# EAGLE design motherboard_Rev1_0 (EAGLE 4.16)
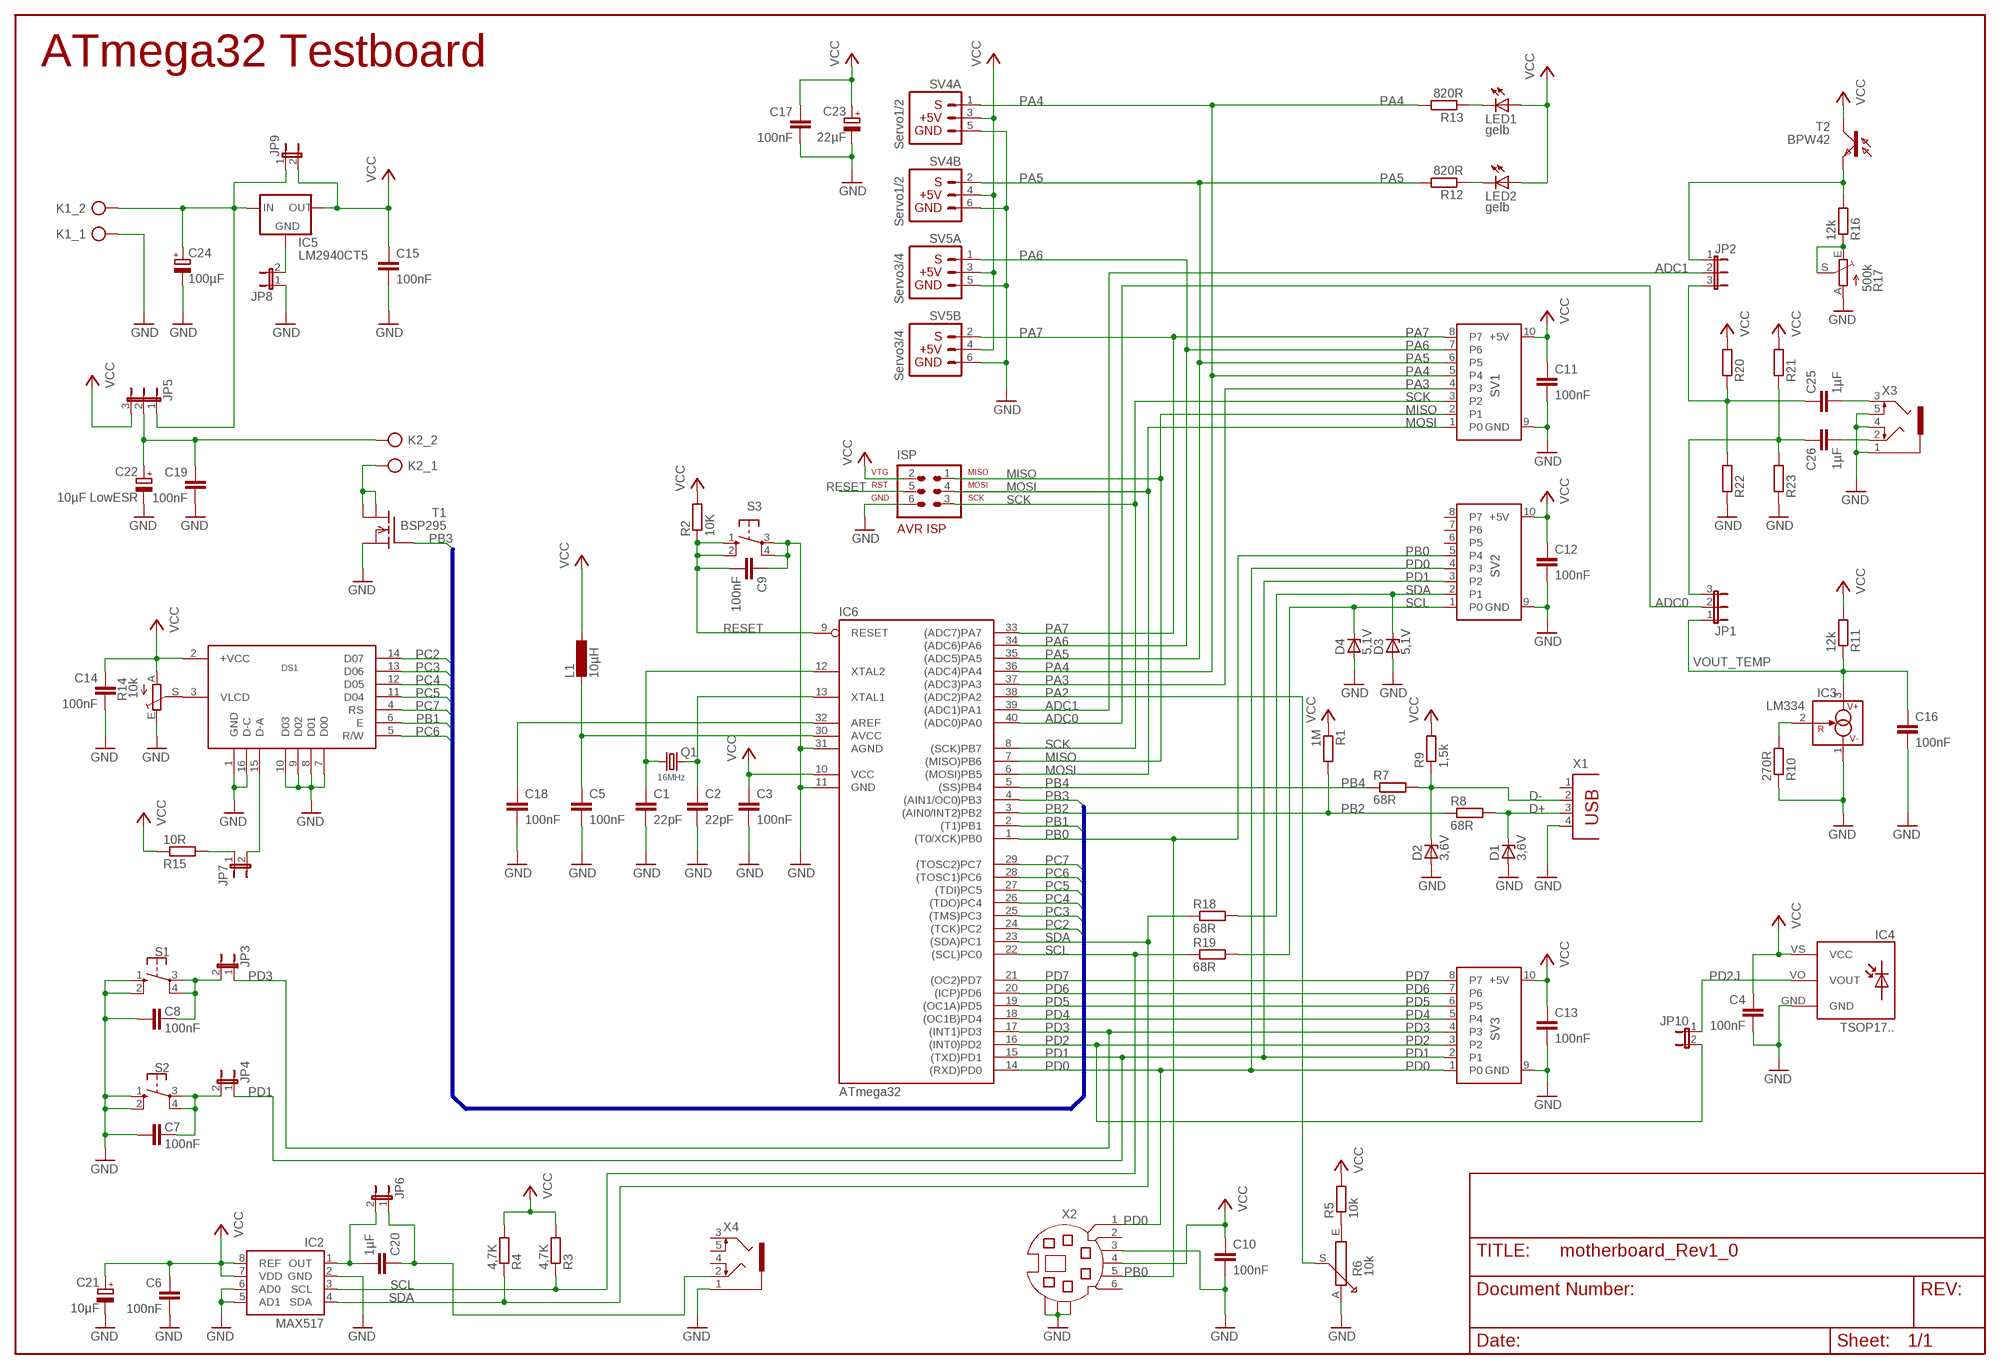
[diagram p0: schematic, sheet 1]

## Parts
C1  22pF  C-EU025-024X044  [C025-024X044]
C2  22pF  C-EU025-024X044  [C025-024X044]
C3  100nF  C-EU050-024X044  [C050-024X044]
C4  100nF  C-EU050-024X044  [C050-024X044]
C5  100nF  C-EU050-024X044  [C050-024X044]
C6  100nF  C-EU050-024X044  [C050-024X044]
C7  100nF  C-EU050-024X044  [C050-024X044]
C8  100nF  C-EU050-024X044  [C050-024X044]
C9  100nF  C-EU050-024X044  [C050-024X044]
C10  100nF  C-EU050-024X044  [C050-024X044]
C11  100nF  C-EU050-024X044  [C050-024X044]
C12  100nF  C-EU050-024X044  [C050-024X044]
C13  100nF  C-EU050-024X044  [C050-024X044]
C14  100nF  C-EU050-024X044  [C050-024X044]
C15  100nF  C-EU050-024X044  [C050-024X044]
C16  100nF  C-EU050-024X044  [C050-024X044]
C17  100nF  C-EU050-024X044  [C050-024X044]
C18  100nF  C-EU050-024X044  [C050-024X044]
C19  100nF  C-EU050-024X044  [C050-024X044]
C20  1µF  C-EU050-050X075  [C050-050X075]
C21  10µF  CPOL-EUE2.5-5  [E2,5-5]
C22  10µF LowESR  CPOL-EUCT6032  [CT6032]
C23  22µF  CPOL-EUE2-5  [E2-5]
C24  100µF  CPOL-EUE2.5-6  [E2,5-6]
C25  1µF  C-EU050-050X075  [C050-050X075]
C26  1µF  C-EU050-050X075  [C050-050X075]
D1  3,6V  ZENER-DIODESOD80C  [SOD80C]
D2  3,6V  ZENER-DIODESOD80C  [SOD80C]
D3  5,1V  ZPD  [DO35Z10]
D4  5,1V  ZPD  [DO35Z10]
DS1  LED_162C_LED  [HDM20216H_OHNE]
IC2  MAX517  [DIL08]
IC3  LM334  [JP2Y]
IC4  TSOP17..  [TSOP17..]
IC5  LM2940CT5  78XXS  [78XXS]
IC6  ATmega32  MEGA16-P  [DIL40]
ISP  AVR-ISP-6  [AVR-ISP-6]
JP1  JP2E  [JP2Y]
JP2  JP2E  [JP2Y]
JP3  JP1E  [JP1Y]
JP4  JP1E  [JP1Y]
JP5  JP2E  [JP2Y]
JP6  JP1E  [JP1Y]
JP7  JP1E  [JP1Y]
JP8  JP1E  [JP1Y]
JP9  JP1E  [JP1Y]
JP10  JP1E  [JP1Y]
K1  AKL_KLEMME_2POLIG073  [AKL073-02]
K2  AKL_KLEMME_2POLIG073  [AKL073-02]
L1  10µH  L-EUL3230M  [L3230M]
LED1  gelb  LED3MM  [LED3MM]
LED2  gelb  LED3MM  [LED3MM]
Q1  16MHz  CRYTALHC49U-V  [HC49U-V]
R1  1M  R-EU_0207/7  [0207/7]
R2  10K  R-EU_0207/7  [0207/7]
R3  4,7K  R-EU_0207/7  [0207/7]
R4  4,7K  R-EU_0207/7  [0207/7]
R5  10k  R-EU_0207/7  [0207/7]
R6  10k  TRIMMER  [P6M-S]
R7  68R  R-EU_0207/7  [0207/7]
R8  68R  R-EU_0207/7  [0207/7]
R9  1,5k  R-EU_0207/7  [0207/7]
R10  270R  R-EU_0207/7  [0207/7]
R11  12k  R-EU_0207/7  [0207/7]
R12  820R  R-EU_0207/7  [0207/7]
R13  820R  R-EU_0207/7  [0207/7]
R14  10k  TRIM_EU-CA6H  [CA6H]
R15  10R  R-EU_0207/7  [0207/7]
R16  12k  R-EU_0207/7  [0207/7]
R17  500k  TRIM_EU-CA6H  [CA6H]
R18  68R  R-EU_0207/7  [0207/7]
R19  68R  R-EU_0207/7  [0207/7]
R20  R-EU_R1206  [R1206]
R21  R-EU_R1206  [R1206]
R22  R-EU_R1206  [R1206]
R23  R-EU_R1206  [R1206]
S1  10-XX  [B3F-10XX]
S2  10-XX  [B3F-10XX]
S3  10-XX  [B3F-10XX]
SV1  PORT_WANNSTECKER  [ML10]
SV2  PORT_WANNSTECKER  [ML10]
SV3  PORT_WANNSTECKER  [ML10]
SV4  Servo1/2  SERVO_SV  [MA03-2]
SV5  Servo3/4  SERVO_SV  [MA03-2]
T1  BSP295  [SOT223]
T2  BPW42  FOTOTRANSISTOR  [FOTOTRAN3MM]
X1  USB  [USB_B_STECKER]
X2  PS2  [PS2]
X3  STEREO_MIT_SCHALTER  [STEREO_MIT_SCHALTER]
X4  STEREO_MIT_SCHALTER  [STEREO_MIT_SCHALTER]

## Nets
ADC0: IC6.40((ADC0)PA0) JP1.2
ADC1: IC6.39((ADC1)PA1) JP2.2
AVCC: C5.1 IC6.30(AVCC) L1.2
D+: D1.C R8.2 X1.3
D-: D2.C R7.2 R9.1 X1.2
GND: C1.2 C2.2 C3.2 C4.2 C5.2 C6.2 C7.1 C8.1 C9.1 C10.2 C11.2 C12.2 C13.2 C14.2 C15.2 C16.2 C17.2 C18.2 C19.2 C21.- C22.- C23.- C24.- D1.A D2.A D3.A D4.A DS1.1(GND) DS1.7(D00) DS1.8(D01) DS1.9(D02) DS1.10(D03) DS1.16(D-C) IC2.2(GND) IC2.5(AD1) IC2.6(AD0) IC3.1(V-) IC4.GND IC6.11(GND) IC6.31(AGND) ISP.6 JP8.1 K1.1 R6.A R10.1 R14.E R17.A R22.1 R23.1 S1.1(S) S1.2(S1) S2.1(S) S2.2(S1) S3.3(P) S3.4(P1) SV1.9(GND) SV2.9(GND) SV3.9(GND) SV4.5(A:GND) SV4.6(B:GND) SV5.5(A:GND) SV5.6(B:GND) T1.3(S) X1.4 X2.3 X2.P$1 X2.P$2 X2.P$3 X3.1 X3.4 X3.5 X4.1
MISO: IC6.7((MISO)PB6) ISP.1 SV1.2(P1)
MOSI: IC6.6((MOSI)PB5) ISP.4 SV1.1(P0)
N$1: C18.1 IC6.32(AREF)
N$2: JP2.1 R16.2 T2.E
N$3: C7.2 JP4.2 S2.3(P) S2.4(P1)
N$4: C8.2 JP3.2 S1.3(P) S1.4(P1)
N$5: R16.1 R17.E R17.S
N$6: C2.1 IC6.13(XTAL1) Q1.2
N$7: C1.1 IC6.12(XTAL2) Q1.1
N$8: C25.1 JP2.3 R20.1 R22.2
N$9: IC3.2(R) R10.2
N$10: K2.1 T1.2(D1) T1.4(D)
N$11: R5.1 R6.E
N$12: LED2.K(C) R12.1
N$13: LED1.K(C) R13.1
N$14: IC5.GND JP8.2
N$15: C25.2 X3.3
N$16: DS1.3(VLCD) R14.S
N$17: D3.C R18.2 SV2.2(P1)
N$18: C20.1 JP6.1 X4.2
N$19: DS1.15(D-A) JP7.2
N$20: C19.1 C22.+ JP5.2 K2.2
N$21: JP7.1 R15.2
N$22: D4.C R19.2 SV2.1(P0)
N$23: C20.2 IC2.1(OUT) JP6.2
N$24: C26.1 JP1.3 R21.1 R23.2
N$25: C24.+ IC5.IN JP5.1 JP9.1 K1.2
N$26: C26.2 X3.2
PA2: IC6.38((ADC2)PA2) R6.S
PA3: IC6.37((ADC3)PA3) SV1.4(P3)
PA4: IC6.36((ADC4)PA4) R13.2 SV1.5(P4) SV4.1(A:S)
PA5: IC6.35((ADC5)PA5) R12.2 SV1.6(P5) SV4.2(B:S)
PA6: IC6.34((ADC6)PA6) SV1.7(P6) SV5.1(A:S)
PA7: IC6.33((ADC7)PA7) SV1.8(P7) SV5.2(B:S)
PB0: IC6.1((T0/XCK)PB0) SV2.5(P4) X2.5
PB1: DS1.6(E) IC6.2((T1)PB1)
PB2: IC6.3((AIN0/INT2)PB2) R1.2 R8.1
PB3: IC6.4((AIN1/OC0)PB3) T1.1(G)
PB4: IC6.5((SS)PB4) R7.1
PC2: DS1.14(D07) IC6.24((TCK)PC2)
PC3: DS1.13(D06) IC6.25((TMS)PC3)
PC4: DS1.12(D05) IC6.26((TDO)PC4)
PC5: DS1.11(D04) IC6.27((TDI)PC5)
PC6: DS1.5(R/W) IC6.28((TOSC1)PC6)
PC7: DS1.4(RS) IC6.29((TOSC2)PC7)
PD0: IC6.14((RXD)PD0) SV2.4(P3) SV3.1(P0) X2.1
PD1: IC6.15((TXD)PD1) JP4.1 SV2.3(P2) SV3.2(P1)
PD2: IC6.16((INT0)PD2) JP10.2 SV3.3(P2)
PD2J: IC4.VO(VOUT) JP10.1
PD3: IC6.17((INT1)PD3) JP3.1 SV3.4(P3)
PD4: IC6.18((OC1B)PD4) SV3.5(P4)
PD5: IC6.19((OC1A)PD5) SV3.6(P5)
PD6: IC6.20((ICP)PD6) SV3.7(P6)
PD7: IC6.21((OC2)PD7) SV3.8(P7)
RESET: C9.2 IC6.9(RESET) ISP.5 R2.1 S3.1(S) S3.2(S1)
SCK: IC6.8((SCK)PB7) ISP.3 SV1.3(P2)
SCL: IC2.3(SCL) IC6.22((SCL)PC0) R3.1 R19.1
SDA: IC2.4(SDA) IC6.23((SDA)PC1) R4.1 R18.1
VCC: C3.1 C4.1 C6.1 C10.1 C11.1 C12.1 C13.1 C14.1 C15.1 C17.1 C21.+ C23.+ DS1.2(+VCC) IC2.7(VDD) IC2.8(REF) IC4.VS(VCC) IC5.OUT IC6.10(VCC) ISP.2 JP5.3 JP9.2 L1.1 LED1.A LED2.A R1.1 R2.2 R3.2 R4.2 R5.2 R9.2 R11.2 R14.A R15.1 R20.2 R21.2 SV1.10(+5V) SV2.10(+5V) SV3.10(+5V) SV4.3(A:+5V) SV4.4(B:+5V) SV5.3(A:+5V) SV5.4(B:+5V) T2.C X2.4
VOUT_TEMP: C16.1 IC3.3(V+) JP1.1 R11.1
Unconnected: SV2.6(P5) SV2.7(P6) SV2.8(P7) X1.1 X2.2 X2.6 X4.3 X4.4 X4.5

## Buses
PC[2..7],PB[1],PB[3]

## Notes on the sheet
- ATmega32 Testboard

## Library data of the parts
C1-C20 C25 C26 = rcl:C-EU: CAPACITOR, European symbol
C21-C24 = rcl:CPOL-EU: POLARIZED CAPACITOR, European symbol
D1 D2 = diode:ZENER-DIODE: Z-Diode
D3 D4 = diode:ZPD: Z DIODE 500 mW
DS1 = FHO-Projekt:LED_162C_LED
IC2 = FHO-Projekt:MAX517: DA-Wandler, 8Bit, I2C, Maxim
IC3 = FHO-Projekt:LM334: Temp. Current Source
IC4 = 01-Optoelektronik:TSOP17..: IR-Empfangsmodul
IC5 = v-reg:78XXS: VOLTAGE REGULATOR
IC6 = FHO-Projekt:MEGA16-P: MICROCONTROLLER 16 Kbytes FLASH 1 kbytes SRAM 512 bytes EEPROM USART 8-channel 10 bit ADC Source: avr.lbr
ISP = eigene_neu:AVR-ISP-6: AVR ISP-6 Serial Programming Header
JP1 JP2 JP5 = jumper:JP2E: JUMPER
JP3 JP4 JP6-JP10 = jumper:JP1E: JUMPER
K1 K2 = 01-Schraubklemmen:AKL_KLEMME_2POLIG: Reichelt Klemme 2-Polig RM5,08
L1 = rcl:L-EU: INDUCTOR, European symbol
LED1 LED2 = led:LED: LED OSRAM: - CHIPLED LG R971, LG N971, LY N971, LG Q971, LY Q971, LO R971, LY R971 LH N974, LH R974 LS Q976, LO Q976, LY Q976 LO Q996 - Hyper CHIPLED LW Q18S LB Q993, LB Q99A, LB R99A - SideLED LS A670, LO A670, LY A670, LG A670, LP A670 LB A673, LV A673, LT A673, LW A673 LH A674 LY A675 LS A676, LA A676, LO A676, LY A676, LW A676 LS A679, LY A679, LG A679 - Hyper Micro SIDELED® LS Y876, LA Y876, LO Y876, LY Y876 LT Y87S - SmartLED LW L88C, LW L88S LB L89C, LB L89S, LG L890 LS L89K, LO L89K, LY L89K LS L896, LA L896, LO L896, LY L896 - TOPLED LS T670, LO T670, LY T670, LG T670, LP T670 LSG T670, LSP T670, LSY T670, LOP T670, LYG T670 LG T671, LOG T671, LSG T671 LB T673, LV T673, LT T673, LW T673 LH T674 LS T676, LA T676, LO T676, LY T676, LB T676, LH T676, LSB T676, LW T676 LB T67C, LV T67C, LT T67C, LS T67K, LO T67K, LY T67K, LW E67C LS E67B, LA E67B, LO E67B, LY E67B, LB E67C, LV E67C, LT E67C LW T67C LS T679, LY T679, LG T679 LS T770, LO T770, LY T770, LG T770, LP T770 LB T773, LV T773, LT T773, LW T773 LH T774 LS E675, LA E675, LY E675, LS T675 LS T776, LA T776, LO T776, LY T776, LB T776 LHGB T686 LT T68C, LB T68C - Hyper Mini TOPLED® LB M676 - Mini TOPLED Santana® LG M470 LS M47K, LO M47K, LY M47K Source: http://www.osram.convergy.de/
Q1 = crystal:CRYTAL: CRYSTAL
R1-R5 R7-R13 R15 R16 R18-R23 = rcl:R-EU_: RESISTOR, European symbol
R6 = FHO-Projekt:TRIMMER: Potentiometer Reichelt
R14 R17 = pot:TRIM_EU-: POTENTIOMETER
S1-S3 = switch-omron:10-XX: OMRON SWITCH
SV1-SV3 = 01-Steckverbinder:PORT_WANNSTECKER
SV4 SV5 = FHO-Projekt:SERVO_SV
T1 = FHO-Projekt:BSP295
T2 = 01-Optoelektronik:FOTOTRANSISTOR
X1 = FHO-Projekt:USB: BERG USB connector
X2 = FHO-Projekt:PS2: YAMAICHI CONNECTOR
X3 X4 = FHO-Projekt:STEREO_MIT_SCHALTER: Jack connectors according to JISC 6560, 3.5 mm Klinkeneinbaukupplung nach JISC 6560, 3,5 mm, 3-polig/ stereo, abgewinkelte Ausführung, mit 2 Öffnern und Lötaugen, für Leiterplatten Rückseitenmontage Source: http://www.lumberg.com/Produkte/PDFs/1503_09.pdf

## Board
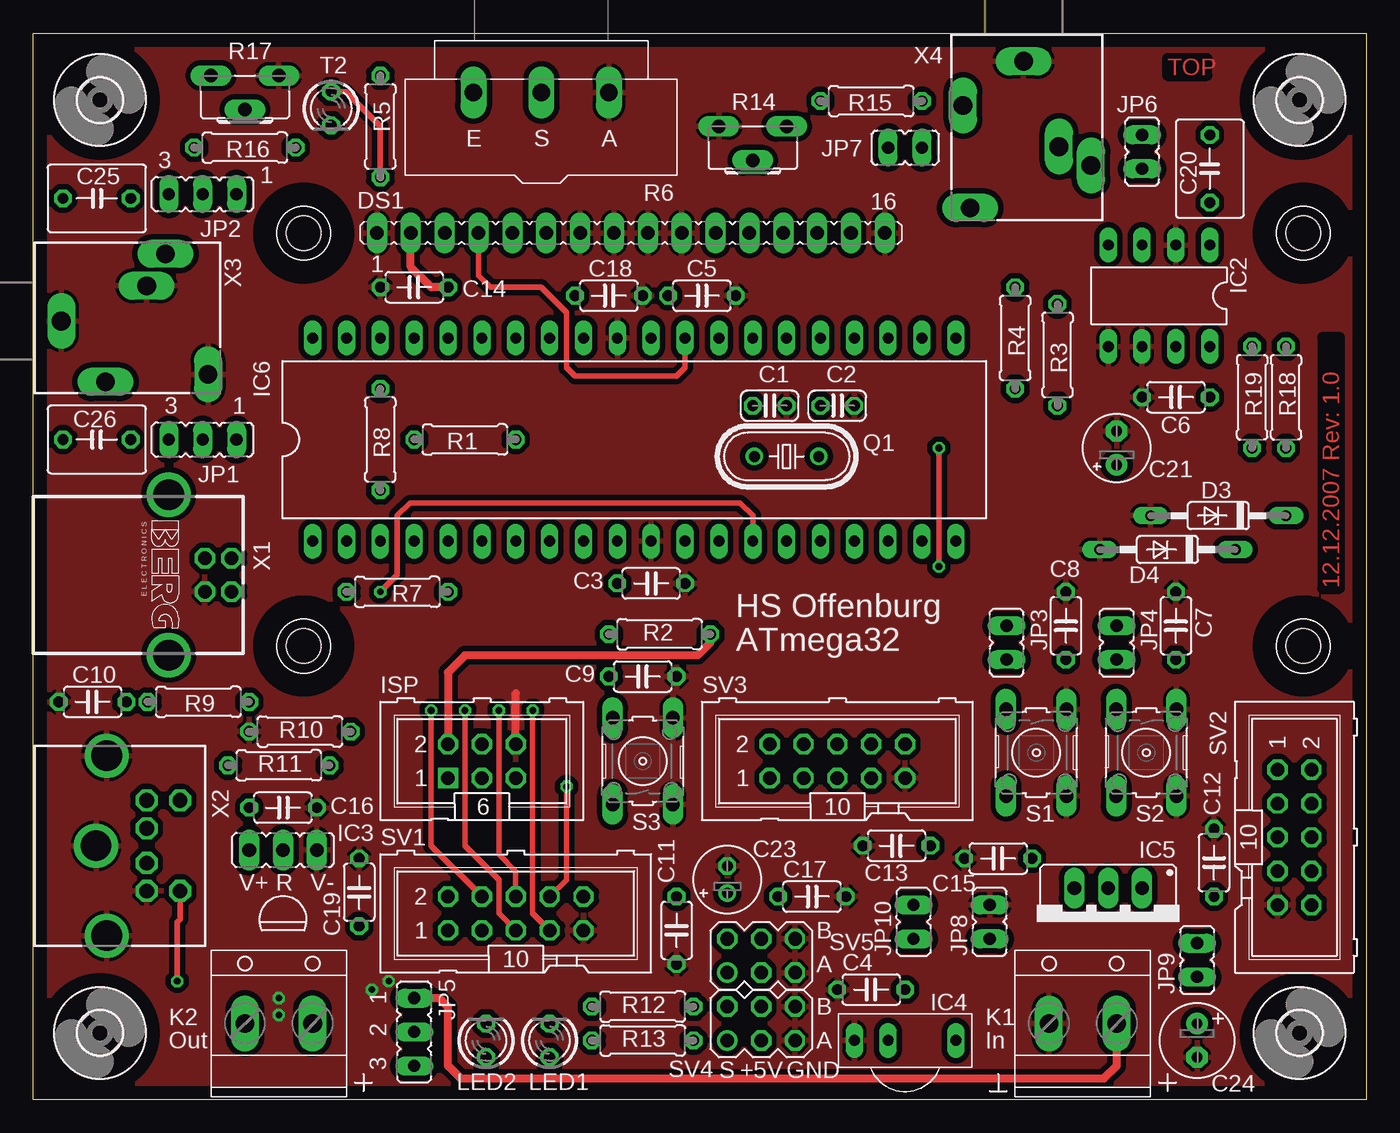
[diagram p1: board, top side]
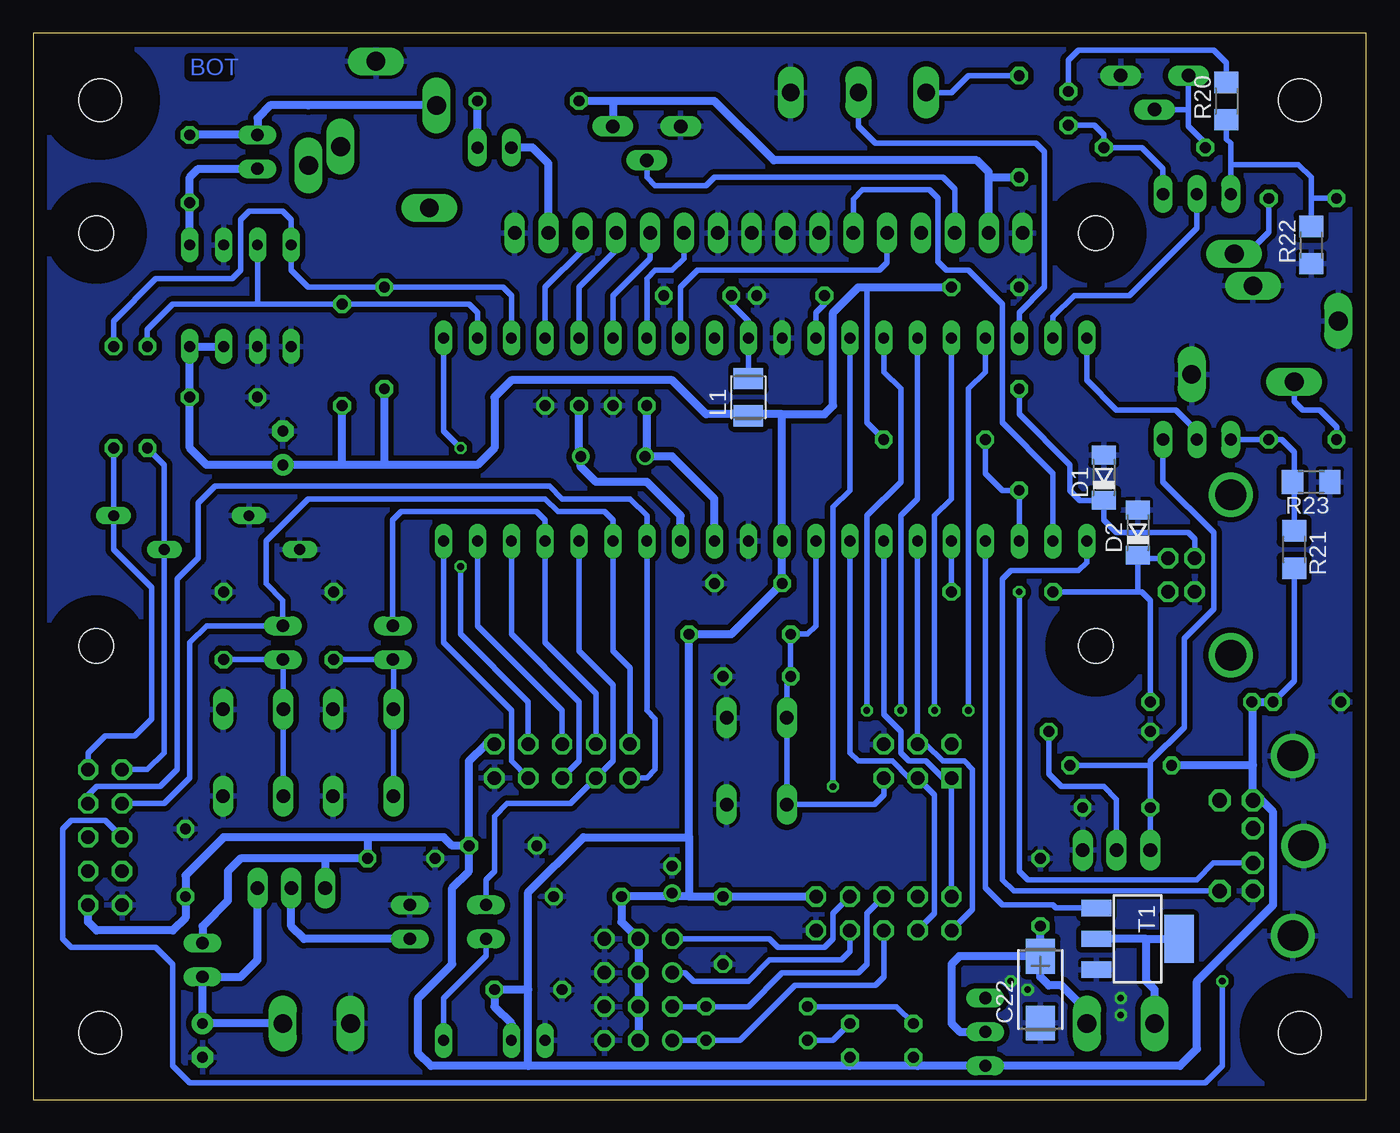
[diagram p2: board, bottom side, seen from below]

Size 100 x 80 mm. Coordinates in mm from the lower left corner, seen from the top.
Outline: 0,0 0,80 100,80 100,0 0,0
Copper layers (1*16): Top 0.035mm / dielectric 1.5mm / Bottom 0.035mm
Design rules "default": minimum track width 6mil, minimum drill 0.4mm, track to track 0.2mm, track to pad 0.2mm, pad to pad 0.2mm, via to via 0.2mm, smd to smd 0.2mm, copper to edge 40mil, drill to drill 0.6mm, minimum pad ring 10mil, minimum via ring 8mil, stop-mask expansion 4mil, vias tented up to drill 0.95mm, thermal gap 10mil
tRestrict: area 17,61.8 to 23.5,68.3; area 92,61.8 to 98.5,68.3; area 92,30.8 to 98.5,37.3; area 17,30.8 to 23.5,37.3
bRestrict: area 17,61.8 to 23.5,68.3; area 17,30.8 to 23.5,37.3; area 92,30.8 to 98.5,37.3; area 92,61.8 to 98.5,68.3

### Footprints (pad centres in the part's own frame; a part is rotated, then mirrored left to right if it is on the bottom)
C025-024X044 = drill 0.813 octagon: 1 -1.27,0; 2 1.27,0
C050-024X044 = drill 0.813 octagon: 1 -2.54,0; 2 2.54,0
C050-050X075 = drill 0.813 octagon: 1 -2.54,0; 2 2.54,0
E2,5-5 = drill 0.813 pad 1.6 round: + -1.27,0 | drill 0.813 pad 1.6 octagon: - 1.27,0
CT6032 = smd 2.6 x 2.2: + 2.5,0; - -2.5,0
E2-5 = drill 0.813 pad 1.27 round: + -1.016,0 | drill 0.813 pad 1.27 octagon: - 1.016,0
E2,5-6 = drill 0.813 pad 1.6 round: + -1.27,0 | drill 0.813 pad 1.6 octagon: - 1.27,0
SOD80C = smd 1.4 x 1.8: A 1.7,0; C -1.7,0
DO35Z10 = drill 0.813 long: A 5.08,0; C -5.08,0
HDM20216H_OHNE = drill 1.016 long: 1 -32.001,15.5; 2 -29.461,15.5; 3 -26.921,15.5; 4 -24.381,15.5; 5 -21.841,15.5; 6 -19.301,15.5; 7 -16.761,15.5; 8 -14.221,15.5; 9 -11.681,15.5; 10 -9.141,15.5; 11 -6.601,15.5; 12 -4.061,15.5; 13 -1.521,15.5; 14 1.019,15.5; 15 3.559,15.5; 16 6.099,15.5 | hole 2.6: -37.5,15.5; 37.5,15.5; 37.5,-15.5; -37.5,-15.5
DIL08 = drill 0.813 long: 1 -3.81,-3.81; 2 -1.27,-3.81; 3 1.27,-3.81; 4 3.81,-3.81; 5 3.81,3.81; 6 1.27,3.81; 7 -1.27,3.81; 8 -3.81,3.81
JP2Y = drill 1.016 long: 1 -2.54,0; 2 0,0; 3 2.54,0
TSOP17.. = drill 0.813 long: GND -3.81,0; VO 3.81,0; VS -1.27,0
78XXS = drill 1.016 long: GND 0,-2.54; IN -2.54,-2.54; OUT 2.54,-2.54
DIL40 = drill 0.813 long: 1 -24.13,-7.62; 2 -21.59,-7.62; 3 -19.05,-7.62; 4 -16.51,-7.62; 5 -13.97,-7.62; 6 -11.43,-7.62; 7 -8.89,-7.62; 8 -6.35,-7.62; 9 -3.81,-7.62; 10 -1.27,-7.62; 11 1.27,-7.62; 12 3.81,-7.62; 13 6.35,-7.62; 14 8.89,-7.62; 15 11.43,-7.62; 16 13.97,-7.62; 17 16.51,-7.62; 18 19.05,-7.62; 19 21.59,-7.62; 20 24.13,-7.62; 21 24.13,7.62; 22 21.59,7.62; 23 19.05,7.62; 24 16.51,7.62; 25 13.97,7.62; 26 11.43,7.62; 27 8.89,7.62; 28 6.35,7.62; 29 3.81,7.62; 30 1.27,7.62; 31 -1.27,7.62; 32 -3.81,7.62; 33 -6.35,7.62; 34 -8.89,7.62; 35 -11.43,7.62; 36 -13.97,7.62; 37 -16.51,7.62; 38 -19.05,7.62; 39 -21.59,7.62; 40 -24.13,7.62
AVR-ISP-6 = drill 1.016 square: 1 -2.54,-1.27 | drill 1.016 octagon: 2 -2.54,1.27; 3 0,-1.27; 4 0,1.27; 5 2.54,-1.27; 6 2.54,1.27
JP2Y' = drill 0.914 long: 1 -2.54,0; 2 0,0; 3 2.54,0
JP1Y = drill 0.914 long: 1 0,-1.27; 2 0,1.27
AKL073-02 = drill 1.4 long: 1 -2.54,0; 2 2.54,0
L3230M = smd 1.6 x 2.2: 1 -1.4,0; 2 1.4,0
LED3MM = drill 0.813 octagon: A -1.27,0; K 1.27,0
HC49U-V = drill 0.813 round: 1 -2.413,0; 2 2.413,0
0207/7 = drill 0.813 octagon: 1 -3.81,0; 2 3.81,0
P6M-S = drill 1.3 long: A -5.08,0; E 5.08,0; S 0,0
CA6H = drill 1.016 long: A -2.54,0; E 2.54,0; S 0,2.54
R1206 = smd 1.6 x 1.8: 1 -1.4,0; 2 1.4,0
B3F-10XX = drill 1.016 long: 1 -3.251,2.261; 2 3.251,2.261; 3 -3.251,-2.261; 4 3.251,-2.261
ML10 = drill 1.016 octagon: 1 -5.08,-1.27; 2 -5.08,1.27; 3 -2.54,-1.27; 4 -2.54,1.27; 5 0,-1.27; 6 0,1.27; 7 2.54,-1.27; 8 2.54,1.27; 9 5.08,-1.27; 10 5.08,1.27
MA03-2 = drill 1.016 round: 1 -2.54,-1.27 | drill 1.016 octagon: 2 -2.54,1.27; 3 0,-1.27; 4 0,1.27; 5 2.54,-1.27; 6 2.54,1.27
SOT223 = smd 1.219 x 2.235: 1 -2.311,-3.099; 2 0,-3.099; 3 2.311,-3.099 | smd 3.6 x 2.2: 4 0,3.099
FOTOTRAN3MM = drill 0.813 octagon: C -1.27,0; E 1.27,0
3,2 = hole 3.2: 0,0
USB_B_STECKER = drill 1.016 octagon: 1 1.25,4.71; 2 -1.25,4.71; 3 -1.25,2.71; 4 1.25,2.71 | drill 2.3 round: P$1 -6.02,0; P$2 6.02,0
PS2 = drill 1.1 octagon: 1 1.3,8.5; 2 -1.3,8.5; 3 3.4,8.5; 4 -3.4,8.5; 5 3.4,11; 6 -3.4,11 | drill 2.3 round: P$1 -6.75,5.51; P$2 0,4.7; P$3 6.75,5.5
STEREO_MIT_SCHALTER = drill 1.4 pad 1.93 long: 1 0,-2.1; 2 -4.55,-5.4; 3 5.05,-9.9; 4 -4,-13.1; 5 2.65,-8.5

### Placement (x,y rotation side)
C1  55.24,52.07 0 top
C2  60.33,52.07 0 top
C3  46.35,38.73 0 top
C4  62.87,8.26 180 top
C5  50.16,60.33 0 top
C6  85.72,52.7 180 top
C7  85.72,35.56 270 top
C8  77.47,35.56 270 top
C9  45.72,31.75 180 top
C10  4.45,29.84 180 top
C11  48.26,12.7 270 top
C12  88.58,17.78 90 top
C13  64.77,19.05 180 top
C14  28.57,60.96 180 top
C15  72.39,18.1 180 top
C16  18.73,21.91 0 top
C17  58.42,15.24 0 top
C18  43.18,60.33 0 top
C19  24.45,15.56 90 top
C20  88.27,69.85 270 top
C21  81.28,48.9 90 top
C22  24.45,8.26 90 bottom
C23  52.07,16.51 90 top
C24  87.31,4.45 270 top
C25  4.76,67.63 0 top
C26  4.76,49.53 180 top
D1  19.68,46.67 90 bottom
D2  17.14,42.55 90 bottom
D3  88.9,43.81 180 top
D4  85.09,41.27 180 top
DS1  57.78,49.53 0 top
IC2  84.45,60.33 180 top
IC3  18.73,18.73 180 top
IC4  65.41,4.45 0 top
IC5  80.64,13.34 180 top
IC6  45.09,49.53 0 top
ISP  33.66,25.4 0 top
JP1  [JP2Y']  12.7,49.53 180 top
JP2  [JP2Y']  12.7,67.94 180 top
JP3  73.03,34.29 180 top
JP4  81.28,34.29 180 top
JP5  [JP2Y']  28.57,5.08 270 top
JP6  83.19,71.12 180 top
JP7  65.41,71.44 90 top
JP8  71.75,13.34 180 top
JP9  87.31,10.48 0 top
JP10  66.04,13.34 0 top
K1  78.74,5.71 0 top
K2  18.41,5.71 0 top
L1  46.35,52.7 90 bottom
LED1  38.73,4.45 90 top
LED2  33.97,4.45 90 top
Q1  56.52,48.26 0 top
R1  32.38,49.53 180 top
R2  46.99,34.92 0 top
R3  76.83,55.88 270 top
R4  73.66,57.15 270 top
R5  26.04,73.03 270 top
R6  38.1,75.56 180 top
R7  27.3,38.1 180 top
R8  26.04,49.53 90 top
R9  12.38,29.84 180 top
R10  20,27.62 0 top
R11  18.41,25.08 180 top
R12  45.72,6.99 0 top
R13  45.72,4.45 0 top
R14  53.98,73.03 180 top
R15  62.87,74.93 0 top
R16  15.88,71.44 0 top
R17  15.88,76.83 180 top
R18  93.98,52.7 270 top
R19  91.44,52.7 270 top
R20  10.48,74.93 90 bottom
R21  5.4,41.27 270 bottom
R22  4.13,64.14 90 bottom
R23  4.13,46.35 180 bottom
S1  75.25,26.04 270 top
S2  83.5,26.04 270 top
S3  45.72,25.4 90 top
SV1  36.2,13.97 0 top
SV2  94.61,19.68 270 top
SV3  60.33,25.4 0 top
SV4  54.61,5.71 0 top
SV5  54.61,10.79 0 top
T1  17.14,12.06 270 bottom
T2  22.34,74.38 270 top
U$1  [3,2]  5,5 0 top
U$2  [3,2]  95,5 0 top
U$3  [3,2]  95,75 0 top
U$4  [3,2]  5,75 0 top
X1  10.16,39.37 270 top
X2  0,19.05 270 top
X3  0,58.42 90 top
X4  74.3,80.01 0 top

### Tracks (layer width: path | path; a pad name or v marks a point on that pad's centre or on a via)
ADC0
  Bottom 0.406: JP1.2 12.7,50.16 14.29,51.75 18.73,51.75 20.95,53.98 IC6.40
ADC1
  Bottom 0.406: JP2.2 12.7,65.41 17.78,60.33 21.91,60.33 23.5,58.74 IC6.39
AVCC
  Bottom 0.406: L1.2 IC6.30 46.35,58.42 47.62,59.69 C5.1
D+
  Bottom 0.406: X1.3 12.87,42.08 13.34,42.55 18.73,42.55 19.68,43.5 D1.C 21.48,44.97 22.23,45.72 22.23,47.62 26.04,51.44 R8.2
D-
  Bottom 0.406: R9.1 16.19,37.47 16.83,38.1 17.14,38.1 | 17.14,38.1 R7.2 | 17.14,38.1 17.14,40.64 | 17.14,40.64 D2.C | X1.2 17.12,40.62 17.14,40.64
GND  (via drill 0.5)
  Top 0.61: ISP.6 36.2,30.48
  other vias: 18.41,6.35 18.41,7.62 25.4,8.26 26.67,8.89
  pour Top (isolate 0.406): 0,0 0,80 100,80 100,0
  pour Bottom (isolate 0.406): 0,0 0,80 100,80 100,0
MISO
  Bottom 0.406: IC6.7 36.2,28.89 34.92,27.62 34.92,26.04 34.29,25.4 33.02,25.4 31.75,24.13 ISP.1 SV1.2
MOSI
  Bottom 0.406: IC6.6 ISP.4 33.02,26.67 31.75,25.4 30.16,25.4 29.53,24.77 29.53,14.29 SV1.1
N$1
  Bottom 0.406: IC6.32 41.27,59.05 40.64,59.69 C18.1
N$2
  Bottom 0.406: T2.E 20.4,73.11 19.68,72.39 R16.2 16.83,71.44 15.24,69.85 JP2.1
N$3
  Bottom 0.406: S2.4 81.24,29.17 81.28,29.21 81.24,29.25 S2.3 81.24,32.98 JP4.2 C7.2
N$4
  Bottom 0.406: S1.4 72.99,29.17 73.03,29.21 72.99,29.25 S1.3 72.99,32.98 JP3.2 C8.2
N$5
  Bottom 0.406: R16.1 11.75,71.44 13.34,73.03 13.34,74.3 | 13.34,74.3 R17.E | 13.34,74.3 R17.S
N$6
  Bottom 0.61: IC6.13 51.44,43.81 53.98,46.35 57.78,46.35 58.93,47.5 Q1.2 59.05,48.26 C2.1
N$7
  Bottom 0.61: IC6.12 48.9,45.09 52.07,48.26 53.98,48.26 | 53.98,48.26 Q1.1 | 53.98,48.26 C1.1
N$8
  Bottom 0.406: R20.1 10.48,72.07 10.16,71.75 10.16,70.17 | 10.16,70.17 JP2.3 | 4.13,67.63 R22.2 | 4.13,67.63 4.13,69.22 5.08,70.17 10.16,70.17 | C25.1 4.13,67.63
N$9
  Bottom 0.406: IC3.2 18.73,22.54 19.68,23.5 22.86,23.5 23.81,24.45 R10.2
N$10
  Bottom 0.61: 20.32,12.06 T1.2 16.51,12.06 | 16.51,12.06 T1.4 | K2.1 15.88,8.26 16.51,8.89 16.51,12.06
N$11
  Bottom 0.406: R5.1 29.84,76.83 31.11,75.56 R6.E
N$12
  Bottom 0.406: R12.1 35.24,6.99 LED2.K
N$13
  Bottom 0.406: LED1.K 40.01,4.45 R13.1
N$14
  Bottom 0.61: JP8.2 79.69,12.06 80.64,13.02 IC5.GND
N$15
  Bottom 0.406: X3.3 8.92,63.47 7.3,65.09 C25.2
N$16
  Bottom 0.406: R14.S 53.98,69.22 53.34,68.58 49.53,68.58 48.9,69.22 31.75,69.22 30.86,68.33 DS1.3
N$17
  Bottom 0.406: R18.2 D3.C 93.98,41.27 91.12,38.42 91.12,28.57 92.39,27.3 94.61,27.3 95.89,26.04 SV2.2
N$18
  Bottom 0.406: 69.85,74.61
  Bottom 0.61: C20.1 JP6.1 83.19,73.66 82.23,74.61 79.38,74.61 | 79.38,74.61 70.38,74.61 69.85,74.61 | 79.38,74.61 79.34,74.58 | X4.2 69.85,74.61
N$19
  Bottom 0.61: JP7.2 62.55,71.44 61.34,70.23 DS1.15
N$20
  Bottom 0.61: C22.+ 30.52,10.76 31.11,10.16 31.11,5.71 30.48,5.08 JP5.2 | C22.+ C19.1 | C22.+ 24.45,9.21 23.81,8.57 22.86,8.57 20.95,6.67 K2.2
N$21
  Bottom 0.61: JP7.1 R15.2
N$22
  Bottom 0.406: R19.2 90.17,47.62 D4.C 90.17,26.04 91.44,24.77 SV2.1
N$23
  Bottom 0.61: IC2.1 C20.2 88.27,69.22 87.63,69.85 JP6.2
N$24
  Bottom 0.406: 5.4,46.35 5.4,48.58 6.35,49.53 C26.1 JP1.3 | 5.4,46.35 R23.2 5.71,46.35 5.4,46.04 R21.1 | 5.4,46.35 5.08,46.35
N$25
  Top 0.61: JP5.1 30.48,7.62 31.11,6.99 31.11,2.54 32.07,1.59 80.33,1.59 81.28,2.54 K1.2
  Bottom 0.61: K1.2 C24.+ JP9.1 84.45,9.21 83.19,10.48 IC5.IN
N$26
  Bottom 0.406: X3.2 5.4,52.39 4.76,51.75 3.49,51.75 2.22,50.48 C26.2
PA2
  Bottom 0.406: IC6.38 26.04,59.05 24.13,60.96 24.13,71.12 24.77,71.75 36.83,71.75 38.1,73.03 R6.S
PA3  (via drill 0.5)
  Top 0.406: v29.84,29.21 29.84,19.05 SV1.4
  Bottom 0.406: v29.84,29.21 29.84,53.34 28.57,54.61 IC6.37
PA4  (via drill 0.5)
  Top 0.406: v32.38,29.21 32.38,19.05 34.92,16.51 34.92,13.97 SV1.5
  Bottom 0.406: SV1.5 36.2,9.21 36.83,8.57 42.86,8.57 46.99,4.45 R13.2 SV4.1 | IC6.36 31.11,45.09 32.38,43.81 v32.38,29.21
PA5  (via drill 0.5)
  Top 0.406: v34.92,29.21 34.92,18.41 36.2,17.14 SV1.6
  Bottom 0.406: SV1.6 37.47,13.97 37.47,10.16 38.1,9.53 43.81,9.53 46.35,6.99 R12.2 SV4.2 | IC6.35 33.66,45.09 34.92,43.81 v34.92,29.21
PA6  (via drill 0.5)
  Top 0.406: v37.47,29.21 37.47,13.97 SV1.7
  Bottom 0.406: SV1.7 38.73,11.11 39.37,10.48 44.77,10.48 46.35,8.89 50.48,8.89 51.12,9.53 SV5.1 | v37.47,29.21 37.47,43.81 34.92,46.35 34.92,53.34 36.2,54.61 IC6.34
PA7  (via drill 0.5)
  Top 0.406: v40.01,23.5 40.01,16.51 SV1.8
  Bottom 0.406: SV1.8 40.01,13.97 40.01,12.06 40.64,11.43 44.13,11.43 44.77,12.06 SV5.2 | IC6.33 38.73,45.72 40.01,44.45 v40.01,23.5
PB0  (via drill 0.5)
  Top 0.406: X2.5 11,13.54 10.79,13.34 v10.79,8.89
  Bottom 0.406: IC6.1 20.95,40.32 21.59,39.69 26.67,39.69 27.3,39.05 27.3,16.51 26.45,15.65 X2.5 | SV2.5 94.61,20.95 97.16,20.95 97.79,20.32 97.79,12.06 97.16,11.43 90.81,11.43 89.53,10.16 89.53,2.54 88.27,1.27 12.06,1.27 10.79,2.54 v10.79,8.89
PB1
  Bottom 0.406: IC6.2 23.5,46.99 27.3,50.8 27.3,59.69 29.84,62.23 31.48,62.23 32.12,62.87 32.12,67.63 32.75,68.26 37.78,68.26 38.48,67.56 DS1.6
PB2
  Bottom 0.406: IC6.3 R8.1 27.3,45.72 28.57,46.99 R1.2
PB3
  Bottom 0.406: IC6.4 28.57,15.88 27.3,14.61 23.5,14.61 23.27,14.38 T1.1
PB4
  Bottom 0.406: R7.1 IC6.5
PC2
  Bottom 0.406: IC6.24 61.59,60.96 58.8,63.75 DS1.14
PC3
  Bottom 0.406: IC6.25 59.05,60.96 56.26,63.75 DS1.13
PC4
  Bottom 0.406: IC6.26 56.52,60.33 53.72,63.12 DS1.12
PC5
  Bottom 0.406: IC6.27 53.98,61.59 53.34,62.23 52.07,62.23 51.18,63.12 DS1.11
PC6
  Bottom 0.406: IC6.28 51.44,60.96 50.16,62.23 36.51,62.23 35.94,62.8 DS1.5
PC7
  Top 0.406: IC6.29 48.9,54.93 48.26,54.29 40.64,54.29 40.01,54.93 40.01,59.05 38.1,60.96 34.29,60.96 33.4,61.85 DS1.4
PD0  (via drill 0.5)
  Top 0.406: IC6.14 53.98,43.81 53.02,44.77 28.26,44.77 27.3,43.81 27.3,39.37 v26.04,38.1
  Bottom 0.406: SV2.4 95.89,22.86 95.25,23.5 90.49,23.5 89.22,24.77 89.22,39.05 87.63,40.64 87.63,44.77 86.36,46.04 61.28,46.04 60.33,45.09 55.24,45.09 53.98,43.81 IC6.14 53.98,29.21 53.34,28.57 53.34,24.77 53.98,24.13 SV3.1 | v26.04,38.1 26.04,17.14 25.4,16.51 12.7,16.51 11.46,17.75 X2.1
PD1
  Bottom 0.406: SV2.3 90.17,22.23 88.27,24.13 88.27,34.29 87,35.56 JP4.1 81.28,37.47 82.55,38.73 82.55,41.91 79.38,45.09 61.59,45.09 60.64,44.13 57.15,44.13 56.52,43.5 IC6.15 56.52,33.66 55.24,32.38 SV3.2
PD2
  Bottom 0.406: IC6.16 59.05,33.66 56.52,31.11 56.52,25.4 SV3.3 59.69,22.23 64.45,22.23 65.41,21.27 65.41,17.14 66.04,16.51 JP10.2
PD2J
  Bottom 0.406: JP10.1 66.04,10.79 69.22,7.62 IC4.VO
PD3
  Bottom 0.406: SV3.4 57.78,30.48 61.59,34.29 IC6.17 61.59,43.5 62.23,44.13 72.39,44.13 73.03,43.5 JP3.1
PD4
  Bottom 0.406: IC6.18 64.14,34.92 59.05,29.84 59.05,25.4 SV3.5
PD5
  Bottom 0.406: IC6.19 66.67,35.56 60.33,29.21 SV3.6
PD6
  Bottom 0.406: IC6.20 69.22,34.29 64.14,29.21 64.14,25.4 SV3.7
PD7  (via drill 0.5)
  Top 0.406: v67.94,40.01 v67.94,48.9
  Bottom 0.406: IC6.21 69.22,50.16 v67.94,48.9 | SV3.8 62.87,29.84 67.94,34.92 v67.94,40.01
RESET
  Bottom 0.406: IC6.9 41.27,35.56 41.91,34.92 R2.1 C9.2 43.46,31.47 S3.2 43.46,22.26 43.5,22.23 43.46,22.19 S3.1 36.91,22.15 36.2,22.86 ISP.5
SCK
  Bottom 0.406: IC6.8 38.73,26.04 38.1,25.4 35.56,25.4 34.29,24.13 ISP.3 32.38,22.86 32.38,13.97 SV1.3
SCL
  Bottom 0.406: 83.19,59.69 IC2.3 | 83.19,59.69 R3.1 67.31,59.69 66.67,59.05 IC6.22 | 83.19,59.69 89.53,59.69 91.44,57.78 R19.1
SDA
  Bottom 0.406: IC6.23 64.14,60.33 64.77,60.96 R4.1 79.38,60.96 80.64,62.23 IC2.4 80.64,66.04 81.28,66.67 83.82,66.67 84.45,66.04 84.45,62.23 85.09,61.59 90.81,61.59 93.98,58.42 R18.1
VCC
  Top 0.406: R5.2 26.04,73.03 23.41,75.64 T2.C
  Top 0.61: C14.1 29.84,60.96 28.32,62.48 DS1.2 | ISP.2 31.11,32.07 32.38,33.34 49.85,33.34 50.8,34.29 R2.2
  Bottom 0.406: R1.1 37.47,50.8 37.47,60.96 | C10.1 5.4,31.43 R21.2 | T2.C 22.34,77.99 21.59,78.74 11.43,78.74 10.48,77.79 R20.2
  Bottom 0.61: IC2.7 IC2.8 C6.1 88.27,48.9 87,47.62 C21.+ 76.83,47.62 | SV4.3 SV4.4 SV5.3 SV5.4 55.88,13.34 C17.1 52.07,15.24 | IC4.VS 64.14,5.71 65.41,6.99 C4.1 62.87,8.26 | C14.1 37.47,60.96 38.1,60.96 40.01,59.05 40.01,52.07 40.64,51.44 43.81,51.44 | 43.81,51.44 IC6.10 C3.1 47.62,34.92 R2.2 50.8,19.68 | C10.1 R9.2 8.57,29.53 8.5,29.45 8.5,25.08 | 8.5,25.08 X2.4 7.84,22.45 6.99,21.59 6.99,14.61 12.7,8.89 12.7,3.81 13.97,2.54 JP5.3 33.66,2.54 | 73.66,47.62 76.83,47.62 | SV2.10 95.89,13.34 95.25,12.7 89.53,12.7 88.58,13.65 C12.1 88.58,16.83 85.72,19.68 74.93,19.68 | 74.93,19.68 69.22,19.68 68.58,19.05 C13.1 | SV3.10 66.04,26.67 67.31,25.4 C13.1 | 73.66,47.62 66.67,47.62 65.41,48.9 65.41,52.7 64.14,53.98 52.07,53.98 49.53,51.44 46.35,51.44 | 73.66,47.62 R4.2 | 76.83,47.62 R3.2 | 56.52,74.93 48.9,74.93 44.45,70.48 29.21,70.48 28.32,69.6 28.32,69.22 | 56.52,74.93 R15.1 | 62.87,2.54 70.17,2.54 71.12,3.49 71.12,7.62 68.58,10.16 68.58,15.88 67.31,17.14 C13.1 | 62.87,2.54 62.87,8.26 | 62.87,8.26 62.87,15.56 58.74,19.68 50.8,19.68 | SV1.10 C11.1 50.8,15.24 | 56.52,74.93 R14.A | JP9.2 87.31,13.02 85.41,14.92 85.41,17.14 84.45,18.1 78.11,18.1 | 78.11,18.1 C15.1 74.93,19.68 | 78.11,18.1 IC5.OUT | 50.8,15.24 52.07,15.24 | 52.07,15.24 C23.+ | 50.8,19.68 50.8,15.24 | 33.66,2.54 38.73,2.54 | 38.73,2.54 62.87,2.54 | LED2.A 33.97,2.86 33.66,2.54 | 38.73,2.54 LED1.A | 43.81,51.44 46.35,51.44 | 46.35,51.44 L1.1 | 8.5,25.08 R11.2 | DS1.2 28.32,69.22 | 28.32,69.22 R5.2
VOUT_TEMP
  Bottom 0.406: 16.19,25.08 C16.1 IC3.3 | 16.19,25.08 16.19,25.4 13.65,27.94 13.65,34.61 11.43,36.83 11.43,42.55 15.24,46.35 JP1.1 | 16.19,25.08 R11.1

### Text on the board
Top: TOP | 12.12.2007 Rev: 1.0
Bottom: BOT
tPlace: V+ | R | V-
tNames: 3 | 1 | 3 | 1 | HS Offenburg | ATmega32 | B | A | 1 | B | 2 | Out | A | In | 3 | S | +5V | GND